# EAGLE design nedonand9 (EAGLE 5.12)
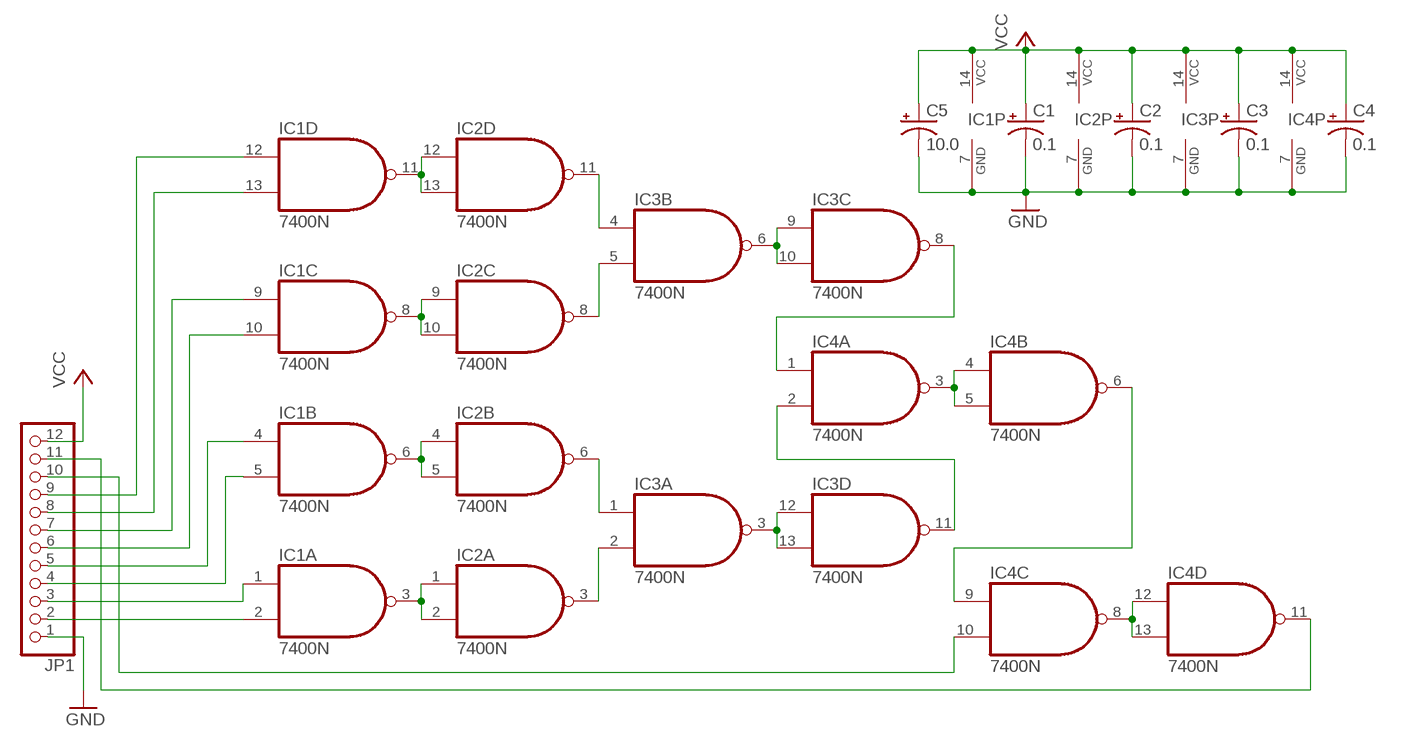
[diagram p0: schematic, sheet 1]

## Parts
C1  0.1  CPOL-USB45181A  [B45181A]
C2  0.1  CPOL-USB45181A  [B45181A]
C3  0.1  CPOL-USB45181A  [B45181A]
C4  0.1  CPOL-USB45181A  [B45181A]
C5  10.0  CPOL-USE2.5-5  [E2,5-5]
IC1  7400N  [DIL14]
IC2  7400N  [DIL14]
IC3  7400N  [DIL14]
IC4  7400N  [DIL14]
JP1  PINHD-1X12/90  [1X12/90]

## Nets
GND: C1.- C2.- C3.- C4.- C5.- IC1.7(P:GND) IC2.7(P:GND) IC3.7(P:GND) IC4.7(P:GND) JP1.1
N$1: IC1.6(B:O) IC2.4(B:I0) IC2.5(B:I1)
N$2: IC4.8(C:O) IC4.12(D:I0) IC4.13(D:I1)
N$3: IC3.6(B:O) IC3.9(C:I0) IC3.10(C:I1)
N$4: IC4.3(A:O) IC4.4(B:I0) IC4.5(B:I1)
N$6: IC1.2(A:I1) JP1.2
N$7: IC1.1(A:I0) JP1.3
N$8: IC1.3(A:O) IC2.1(A:I0) IC2.2(A:I1)
N$9: IC2.3(A:O) IC3.2(A:I1)
N$10: IC1.5(B:I1) JP1.4
N$11: IC1.4(B:I0) JP1.5
N$12: IC1.10(C:I1) JP1.6
N$13: IC1.9(C:I0) JP1.7
N$14: IC1.13(D:I1) JP1.8
N$15: IC1.12(D:I0) JP1.9
N$16: IC4.10(C:I1) JP1.10
N$18: IC4.11(D:O) JP1.11
N$19: IC2.6(B:O) IC3.1(A:I0)
N$20: IC1.8(C:O) IC2.9(C:I0) IC2.10(C:I1)
N$21: IC1.11(D:O) IC2.12(D:I0) IC2.13(D:I1)
N$22: IC2.11(D:O) IC3.4(B:I0)
N$23: IC2.8(C:O) IC3.5(B:I1)
N$24: IC3.8(C:O) IC4.1(A:I0)
N$25: IC3.11(D:O) IC4.2(A:I1)
N$26: IC3.3(A:O) IC3.12(D:I0) IC3.13(D:I1)
N$27: IC4.6(B:O) IC4.9(C:I0)
VCC: C1.+ C2.+ C3.+ C4.+ C5.+ IC1.14(P:VCC) IC2.14(P:VCC) IC3.14(P:VCC) IC4.14(P:VCC) JP1.12

## Library data of the parts
C1-C5 = rcl:CPOL-US: POLARIZED CAPACITOR, American symbol
IC1-IC4 = 74xx-us:74*00: Quad 2-input NAND gate
JP1 = pinhead:PINHD-1X12: PIN HEADER

## Board
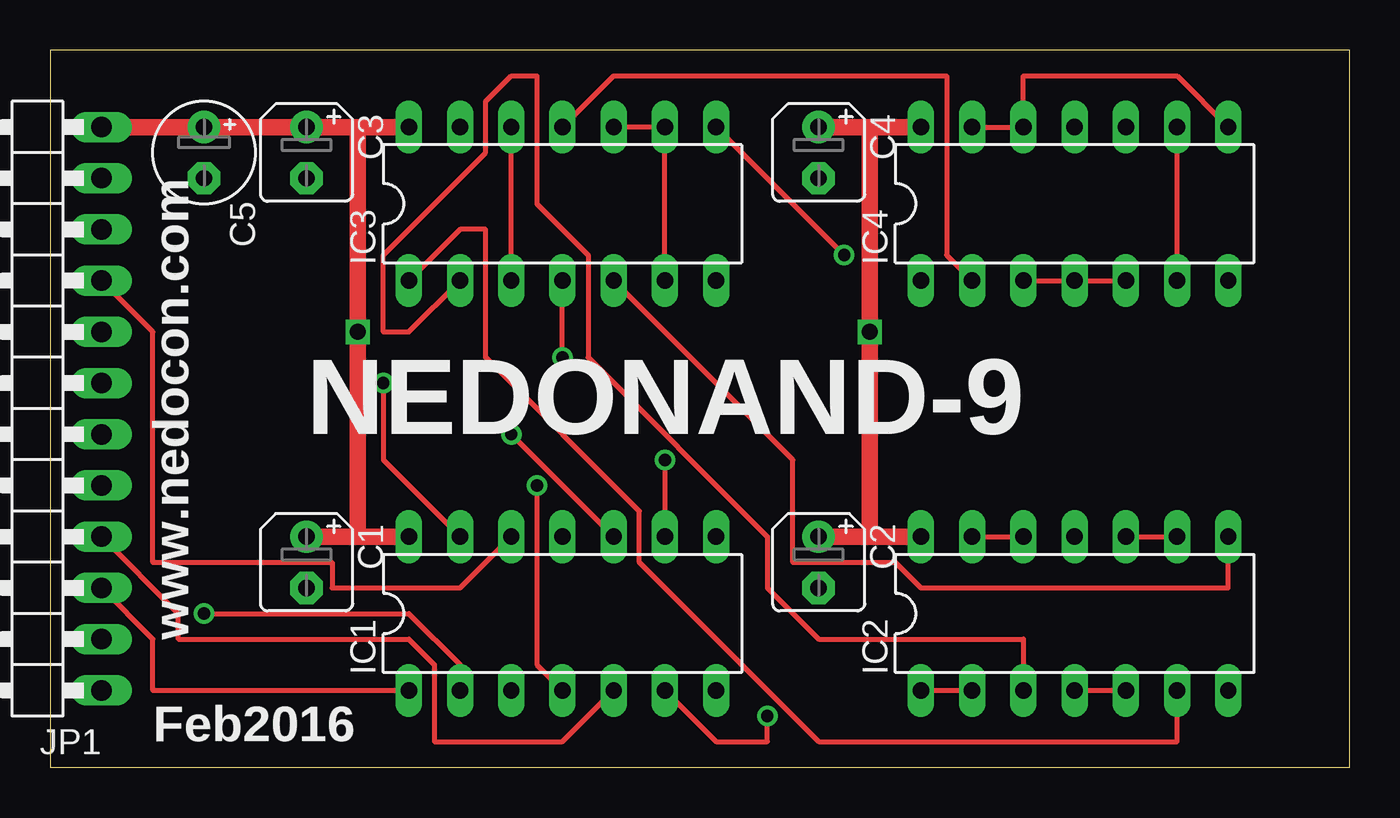
[diagram p1: board, top side]
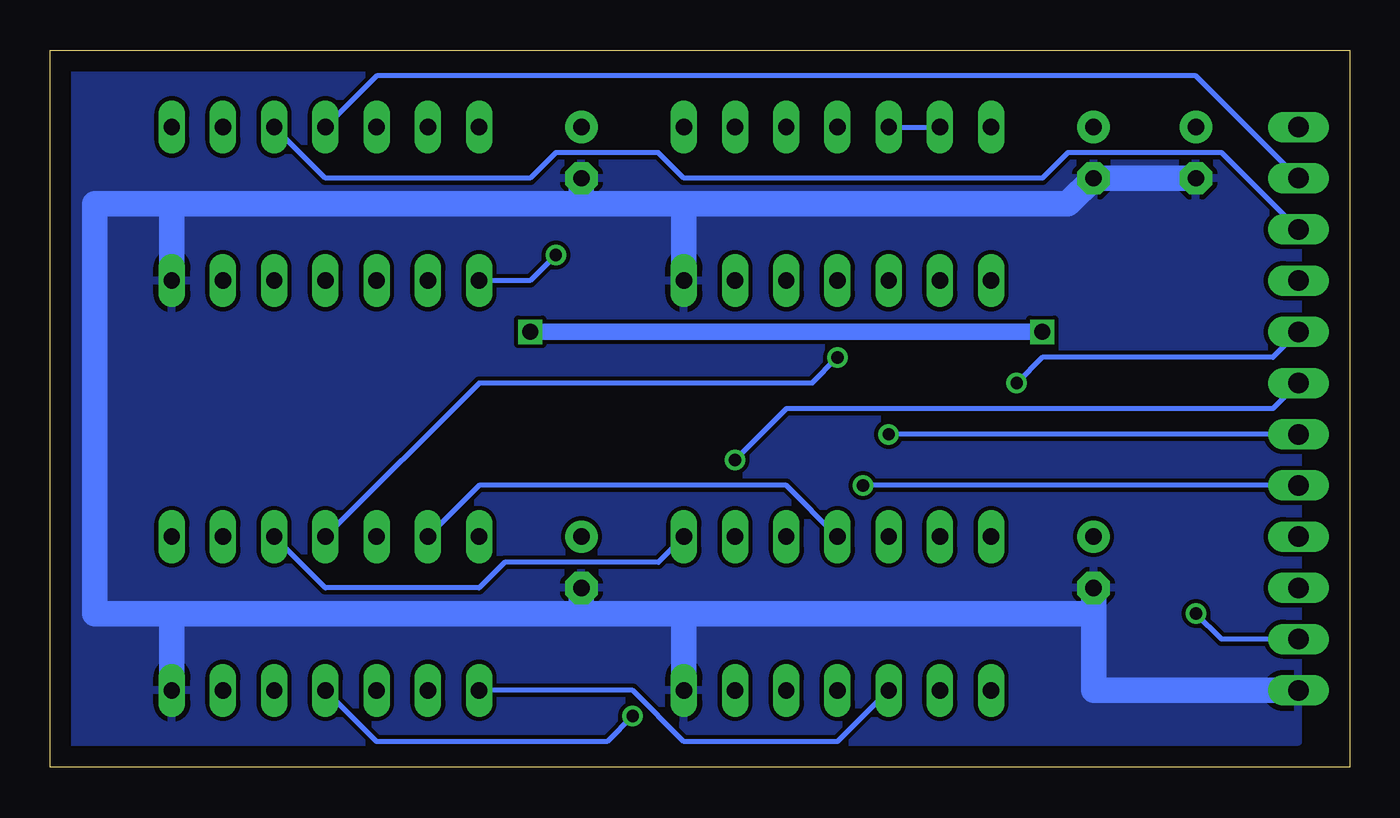
[diagram p2: board, bottom side, seen from below]

Size 64.44 x 35.55 mm. Coordinates in mm from the lower left corner, seen from the top.
Outline: 0,0 64.44,0 64.44,35.55 0,35.55 0,0
Copper layers (1*16): Top 0.035mm / dielectric 1.5mm / Bottom 0.035mm
Design rules "default": minimum track width 10mil, minimum drill 24mil, track to track 8mil, track to pad 8mil, pad to pad 8mil, via to via 8mil, smd to smd 8mil, copper to edge 40mil, drill to drill 8mil, minimum pad ring 10mil, minimum via ring 8mil, stop-mask expansion 4mil, vias tented up to drill 0mil, thermal gap 10mil

### Footprints (pad centres in the part's own frame; a part is rotated, then mirrored left to right if it is on the bottom)
B45181A = drill 0.813 pad 1.6 round: + -1.27,0 | drill 0.813 pad 1.6 octagon: - 1.27,0
E2,5-5 = drill 0.813 pad 1.6 round: + -1.27,0 | drill 0.813 pad 1.6 octagon: - 1.27,0
DIL14 = drill 0.813 long: 1 -7.62,-3.81; 2 -5.08,-3.81; 3 -2.54,-3.81; 4 0,-3.81; 5 2.54,-3.81; 6 5.08,-3.81; 7 7.62,-3.81; 8 7.62,3.81; 9 5.08,3.81; 10 2.54,3.81; 11 0,3.81; 12 -2.54,3.81; 13 -5.08,3.81; 14 -7.62,3.81
1X12/90 = drill 1.016 long: 1 -13.97,-3.81; 2 -11.43,-3.81; 3 -8.89,-3.81; 4 -6.35,-3.81; 5 -3.81,-3.81; 6 -1.27,-3.81; 7 1.27,-3.81; 8 3.81,-3.81; 9 6.35,-3.81; 10 8.89,-3.81; 11 11.43,-3.81; 12 13.97,-3.81

### Placement (x,y rotation side)
C1  12.7,10.16 270 top
C2  38.1,10.16 270 top
C3  12.7,30.48 270 top
C4  38.1,30.48 270 top
C5  7.62,30.48 270 top
IC1  25.4,7.62 0 top
IC2  50.8,7.62 0 top
IC3  25.4,27.94 0 top
IC4  50.8,27.94 0 top
JP1  -1.27,17.78 90 top

### Tracks (layer width: path | path; a pad name or v marks a point on that pad's centre or on a via)
GND
  Bottom 1.27: JP1.1 12.7,3.81 12.7,7.62 | 12.7,7.62 C1.- | 58.42,7.62 IC2.7 | 12.7,7.62 33.02,7.62 | 33.02,7.62 38.1,7.62 | 38.1,7.62 58.42,7.62 | 38.1,7.62 C2.- | 33.02,7.62 IC1.7 | 58.42,7.62 62.23,7.62 62.23,27.94 58.42,27.94 | 58.42,27.94 38.1,27.94 | 38.1,27.94 33.02,27.94 | 33.02,27.94 13.97,27.94 C3.- C5.- | 33.02,27.94 IC3.7 | 38.1,27.94 C4.- | 58.42,27.94 IC4.7
  pour Bottom: 2.54,34.29 63.5,34.29 63.5,1.27 2.54,1.27
N$1  (via drill 0.61)
  Top 0.254: IC1.6 33.02,1.27 35.56,1.27 v35.56,2.54 | IC2.4 IC2.5
  Bottom 0.254: v35.56,2.54 36.83,1.27 48.26,1.27 IC2.4
N$2
  Top 0.254: IC4.13 IC4.12 48.26,34.29 55.88,34.29 IC4.8
N$3
  Top 0.254: IC3.10 IC3.9 IC3.6
N$4
  Top 0.254: IC4.3 IC4.4 IC4.5
N$6  (via drill 0.61)
  Top 0.254: IC1.2 20.32,5.08 17.78,7.62 v7.62,7.62
  Bottom 0.254: v7.62,7.62 6.35,6.35 JP1.2
N$7
  Top 0.254: IC1.1 5.08,3.81 5.08,6.35 JP1.3
N$8
  Top 0.254: IC2.1 IC2.2
  Bottom 0.254: IC1.3 25.4,1.27 33.02,1.27 35.56,3.81 IC2.1
N$9
  Top 0.254: IC3.2 17.78,21.59 16.51,21.59 16.51,25.4 21.59,30.48 21.59,33.02 22.86,34.29 24.13,34.29 24.13,27.94 26.67,25.4 26.67,20.32 35.56,11.43 35.56,8.89 38.1,6.35 48.26,6.35 IC2.3
N$10
  Top 0.254: IC1.5 25.4,1.27 19.05,1.27 19.05,5.08 17.78,6.35 6.35,6.35 6.35,7.62 JP1.4
N$11  (via drill 0.61)
  Top 0.254: IC1.4 24.13,5.08 v24.13,13.97
  Bottom 0.254: JP1.5 v24.13,13.97
N$12  (via drill 0.61)
  Top 0.254: v22.86,16.51 IC1.10
  Bottom 0.254: JP1.6 v22.86,16.51
N$13  (via drill 0.61)
  Top 0.254: v30.48,15.24 IC1.9
  Bottom 0.254: v30.48,15.24 27.94,17.78 3.81,17.78 JP1.7
N$14  (via drill 0.61)
  Top 0.254: IC1.13 16.51,15.24 v16.51,19.05
  Bottom 0.254: v16.51,19.05 15.24,20.32 3.81,20.32 JP1.8
N$15
  Top 0.254: IC1.12 20.32,8.89 13.97,8.89 13.97,10.16 5.08,10.16 5.08,21.59 JP1.9
N$16
  Bottom 0.254: IC4.10 50.8,29.21 40.64,29.21 39.37,30.48 34.29,30.48 33.02,29.21 15.24,29.21 13.97,30.48 6.35,30.48 JP1.10
N$18
  Bottom 0.254: IC4.11 48.26,34.29 7.62,34.29 JP1.11
N$19
  Top 0.254: IC3.1 20.32,26.67 21.59,26.67 21.59,20.32 29.21,12.7 29.21,10.16 38.1,1.27 55.88,1.27 IC2.6
N$20
  Top 0.254: IC2.10 IC2.9
  Bottom 0.254: IC1.8 34.29,10.16 41.91,10.16 43.18,8.89 50.8,8.89 IC2.10
N$21
  Top 0.254: IC2.13 IC2.12
  Bottom 0.254: IC1.11 27.94,13.97 43.18,13.97 IC2.13
N$22  (via drill 0.61)
  Top 0.254: v25.4,20.32 IC3.4
  Bottom 0.254: v25.4,20.32 26.67,19.05 43.18,19.05 IC2.11
N$23
  Top 0.254: IC3.5 36.83,15.24 36.83,10.16 41.91,10.16 43.18,8.89 58.42,8.89 IC2.8
N$24  (via drill 0.61)
  Top 0.254: IC3.8 v39.37,25.4
  Bottom 0.254: v39.37,25.4 40.64,24.13 IC4.1
N$25
  Top 0.254: IC3.11 27.94,34.29 44.45,34.29 44.45,25.4 IC4.2
N$26
  Top 0.254: IC3.3 IC3.12
  Bottom 0.254: IC3.12 IC3.13
N$27
  Top 0.254: IC4.6 IC4.9
VCC  (via drill 0.8)
  Top 0.813: JP1.12 C5.+ C3.+ 15.24,31.75 | 15.24,31.75 IC3.14 | C1.+ 15.24,11.43 | 15.24,11.43 IC1.14 | 40.64,11.43 C2.+ | 40.64,11.43 IC2.14 | 40.64,31.75 IC4.14 | 40.64,11.43 v40.64,21.59 40.64,31.75 | 40.64,31.75 C4.+ | 15.24,31.75 v15.24,21.59 15.24,11.43
  Bottom 0.813: v15.24,21.59 v40.64,21.59

### Text on the board
tNames: www.nedocon.com | NEDONAND-9 | Feb2016